# Altium project wireless_pedal.PrjPcb
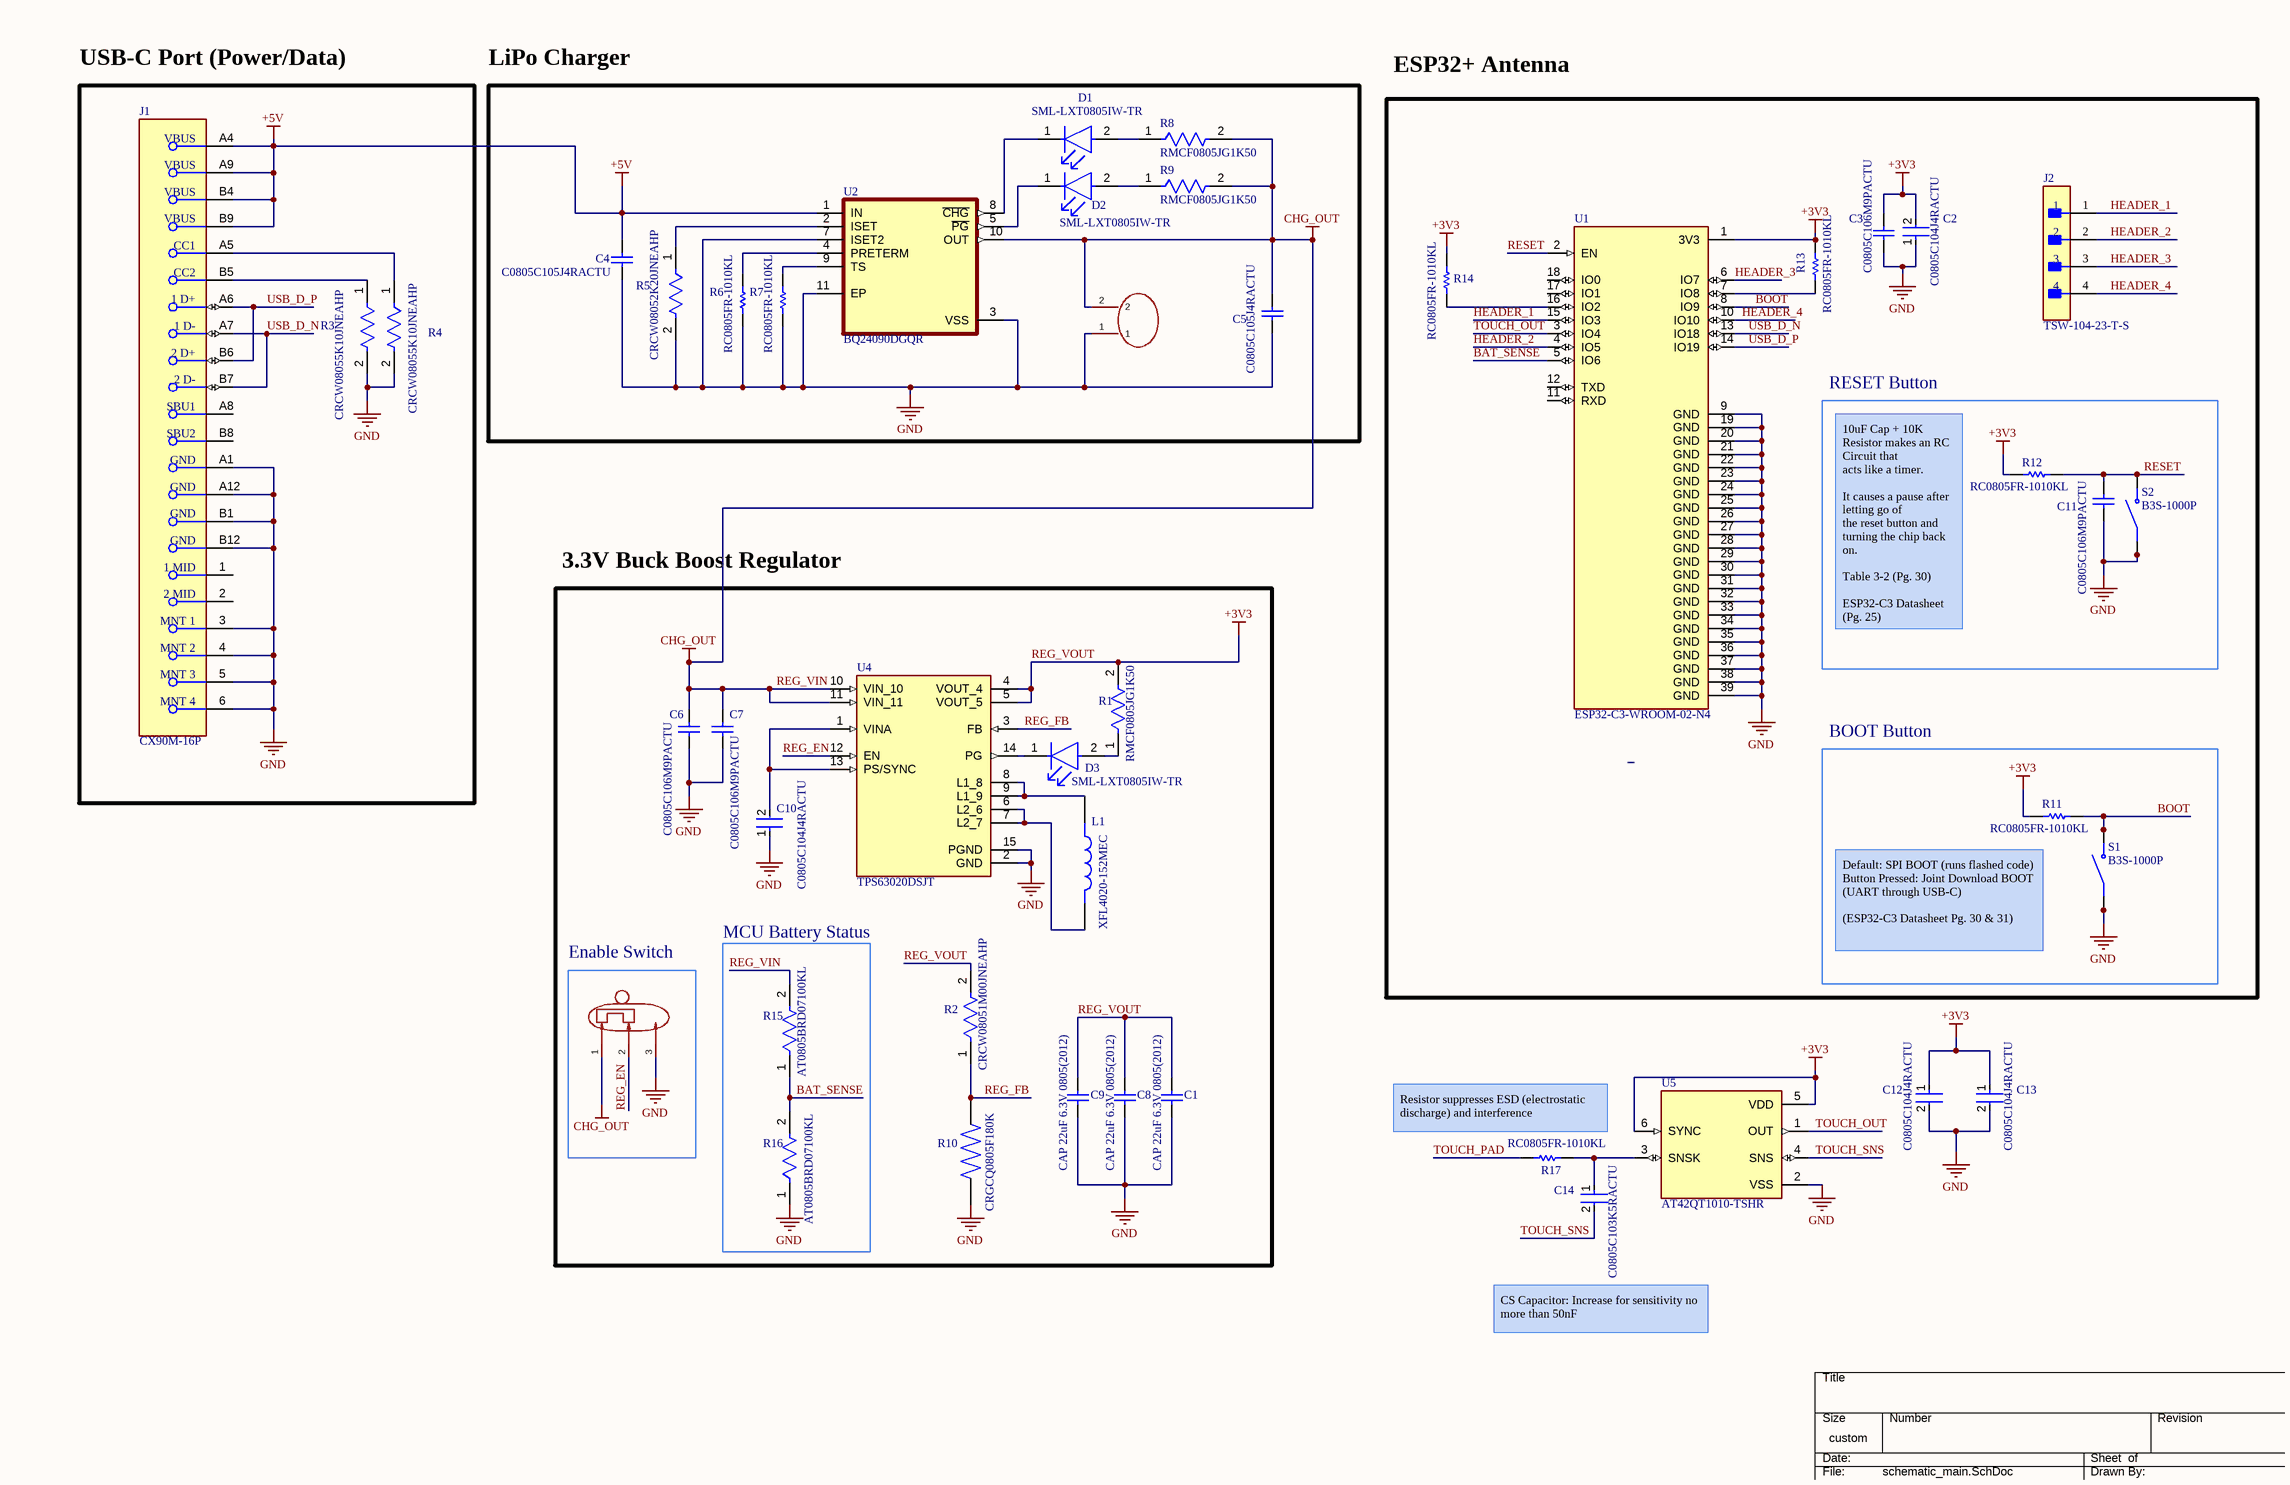
[diagram p0: schematic_main.SchDoc]
1 sheet, 45 parts. Net scope: global (net labels, ports and power ports of the same name join across sheets).
Board files: pcb_main.PcbDoc, pcb_4_layer.PcbDoc

## Sheet schematic_main.SchDoc: *wireless_pedal
size 431 x 279 mm; Author: *Me; DrawnBy: Me; SheetNumber: 1; SheetTotal: 1

### Parts
C1  CAP 22uF 6.3V 0805(2012)  [CAPC0805(2012)145_L]
C2  C0805C104J4RACTU  [FP-C0805C-DN-IPC_A]
C3  C0805C106M9PACTU  [CAPC2013X145X50LL20T25]
C4  C0805C105J4RACTU  [CAPC2013X140X50LL20T25]
C5  C0805C105J4RACTU  [CAPC2013X140X50LL20T25]
C6  C0805C106M9PACTU  [CAPC2013X145X50LL20T25]
C7  C0805C106M9PACTU  [CAPC2013X145X50LL20T25]
C8  CAP 22uF 6.3V 0805(2012)  [CAPC0805(2012)145_L]
C9  CAP 22uF 6.3V 0805(2012)  [CAPC0805(2012)145_L]
C10  C0805C104J4RACTU  [FP-C0805C-DN-IPC_A]
C11  C0805C106M9PACTU  [CAPC2013X145X50LL20T25]
C12  C0805C104J4RACTU  [FP-C0805C-DN-IPC_A]
C13  C0805C104J4RACTU  [FP-C0805C-DN-IPC_A]
C14  C0805C103K5RACTU  [FP-C0805C-DN-IPC_A]
CN1  b2b-ph-k-s(lf)(sn)  [CONN-TH_B2B-PH-K-S]  (value not drawn)
D1  SML-LXT0805IW-TR  [FP-SML-LXT0805IW-TR-MFG]
D2  SML-LXT0805IW-TR  [FP-SML-LXT0805IW-TR-MFG]
D3  SML-LXT0805IW-TR  [FP-SML-LXT0805IW-TR-MFG]
J1  CX90M-16P  [FP-CX90M-16P-MFG]
J2  TSW-104-23-T-S  [FP-TSW-104-23-T-S-MFG]
L1  XFL4020-152MEC  [IND_XFL4020-152MEC]
R1  RMCF0805JG1K50  [FP-RMCF0805-IPC_A]
R2  CRCW08051M00JNEAHP  [FP-CRCW0805-HPe3-IPC_A]
R3  CRCW08055K10JNEAHP  [FP-CRCW0805-HPe3-IPC_A]
R4  CRCW08055K10JNEAHP  [FP-CRCW0805-HPe3-IPC_A]
R5  CRCW08052K20JNEAHP  [FP-CRCW0805-HPe3-IPC_A]
R6  RC0805FR-1010KL  [RESC2013X60X35LL10T20]
R7  RC0805FR-1010KL  [RESC2013X60X35LL10T20]
R8  RMCF0805JG1K50  [FP-RMCF0805-IPC_A]
R9  RMCF0805JG1K50  [FP-RMCF0805-IPC_A]
R10  CRGCQ0805F180K  [RESC2012X65N]
R11  RC0805FR-1010KL  [RESC2013X60X35LL10T20]
R12  RC0805FR-1010KL  [RESC2013X60X35LL10T20]
R13  RC0805FR-1010KL  [RESC2013X60X35LL10T20]
R14  RC0805FR-1010KL  [RESC2013X60X35LL10T20]
R15  AT0805BRD07100KL  [FP-AT0805-IPC_A]
R16  AT0805BRD07100KL  [FP-AT0805-IPC_A]
R17  RC0805FR-1010KL  [RESC2013X60X35LL10T20]
S1  B3S-1000P  [SW_B3S-1000P]
S2  B3S-1000P  [SW_B3S-1000P]
U1  ESP32-C3-WROOM-02-N4  [MODULE_ESP32-C3-WROOM-02-H4]
U2  BQ24090DGQR  [IC_XTR111AIDGQR]
U3  ss-12d00-g3  [SW-TH_3P-L8.8-W3.9-P2.50_SS12D00G3]  (value not drawn)
U4  TPS63020DSJT  [IC_TPS63020DSJT]
U5  AT42QT1010-TSHR  [SOT95P270X145-6N]

### Blocks framed on the sheet
USB-C Port (Power/Data): J1 R3 R4
LiPo Charger: C4 C5 CN1 D1 D2 R5-R9 U2
RESET Button: C11 R12 S2
3.3V Buck Boost Regulator: C1 C6-C10 D3 L1 R1 R2 R10 U4
BOOT Button: R11 S1
Enable Switch: U3
MCU Battery Status: R15 R16

### Nets
+5V: C4.2 J1.A4(VBUS) J1.A9(VBUS) J1.B4(VBUS) J1.B9(VBUS) U2.1(IN)
GND: C1.2 C2.1 C3.2 C4.1 C5.1 C6.1 C7.1 C8.2 C9.2 C10.1 C11.1 C12.2 C13.2 CN1.1 J1.3(MNT_1) J1.4(MNT_2) J1.5(MNT_3) J1.6(MNT_4) J1.A1(GND) J1.A12(GND) J1.B1(GND) J1.B12(GND) R3.2 R4.2 R5.2 R6.1 R7.1 R10.1 R16.1 S1.1(COM) S1.2(COM) S2.1(COM) S2.2(COM) U1.9(GND) U1.19(GND) U1.20(GND) U1.21(GND) U1.22(GND) U1.23(GND) U1.24(GND) U1.25(GND) U1.26(GND) U1.27(GND) U1.28(GND) U1.29(GND) U1.30(GND) U1.31(GND) U1.32(GND) U1.33(GND) U1.34(GND) U1.35(GND) U1.36(GND) U1.37(GND) U1.38(GND) U1.39(GND) U2.3(VSS) U2.7(ISET2) U2.11(EP) U3.3 U4.2(GND) U4.15(PGND) U5.2(VSS)
REG_VIN: C5.2 C6.2 C7.2 CN1.2 R8.2 R9.2 R15.2 U2.10(OUT) U3.1 U4.10(VIN_10) U4.11(VIN_11)  [also labelled CHG_OUT]
REG_VOUT: C1.1 C2.2 C3.1 C8.1 C9.1 C12.1 C13.1 R1.2 R2.2 R11.1 R12.1 R13.2 R14.2 U1.1(3V3) U4.4(VOUT_4) U4.5(VOUT_5) U5.5(VDD) U5.6(SYNC)  [also labelled +3V3]
BAT_SENSE: R15.1 R16.2 U1.5(IO6)
BOOT: R11.2 S1.3(NO) S1.4(NO) U1.8(IO9)
HEADER_1: J2.1 U1.15(IO3)
HEADER_2: J2.2 U1.4(IO5)
HEADER_3: J2.3 U1.6(IO7)
HEADER_4: J2.4 U1.10(IO10)
REG_EN: U3.2 U4.12(EN)
REG_FB: R2.1 R10.2 U4.3(FB)
RESET: C11.2 R12.2 S2.3(NO) S2.4(NO) U1.2(EN)
TOUCH_OUT: U1.3(IO4) U5.1(OUT)
TOUCH_PAD: R17.1
TOUCH_SNS: C14.2 U5.4(SNS)
USB_D_N: J1.A7(1_D-) J1.B7(2_D-) U1.13(IO18)
USB_D_P: J1.A6(1_D+) J1.B6(2_D+) U1.14(IO19)
NetC10_2: C10.2 U4.1(VINA) U4.13(PS/SYNC)
NetC14_1: C14.1 R17.2 U5.3(SNSK)
NetD1_1: D1.1(C) U2.8(~{CHG})
NetD1_2: D1.2(A) R8.1
NetD2_1: D2.1(C) U2.5(~{PG})
NetD2_2: D2.2(A) R9.1
NetD3_1: D3.1(C) U4.14(PG)
NetD3_2: D3.2(A) R1.1
NetJ1_A5: J1.A5(CC1) R4.1
NetJ1_B5: J1.B5(CC2) R3.1
NetL1_1: L1.1 U4.8(L1_8) U4.9(L1_9)
NetL1_2: L1.2 U4.6(L2_6) U4.7(L2_7)
NetR5_1: R5.1 U2.2(ISET)
NetR6_2: R6.2 U2.4(PRETERM)
NetR7_2: R7.2 U2.9(TS)
NetR13_1: R13.1 U1.7(IO8)
NetR14_1: R14.1 U1.16(IO2)

Not connected (* = marked no-connect by the designer): J1 1(1_MID) 2(2_MID) A8(SBU1) B8(SBU2); U1 11(RXD) 12(TXD) 17(IO1) 18(IO0)

### Notes on the sheet
- ESP32+ Antenna
- 10uF Cap + 10K Resistor makes an RC Circuit that
  acts like a timer.
  It causes a pause after letting go of
  the reset button and turning the chip back on.
  Table 3-2 (Pg. 30)
  ESP32-C3 Datasheet (Pg. 25)
- (near R11) Default: SPI BOOT (runs flashed code)
  Button Pressed: Joint Download BOOT (UART through USB-C)
  (ESP32-C3 Datasheet Pg. 30 & 31)
- (near R17) Resistor suppresses ESD (electrostatic discharge) and interference
- CS Capacitor: Increase for sensitivity no more than 50nF
- DWG. NO.
- REV.
- SHT.
- THIS DOCUMENT AND THE DATA DISCLOSED HEREIN OR HEREWITH IS THE PROPERTY OF ALTIUM LIMITED AND MAY BE FREELY DISTRIBUTED IN WHOLE. NO RIGHTS ARE RESERVED OR EXPRESS OR IMPLIED WARANTEE GIVEN.
- REVISION
- DESCRIPTION
- DATE
- APPROVED
- ENG:
- APPROVALS
- PROJECT
- DSN:
- CHK:
- REFERENCE DOCUMENTS
- PROJECT REVISION:
- TITLE
- DOCUMENT REVISION:
- DESIGN ITEM:
- BOM:
- FAB DWG:
- PCB DWG:
- ASSY DWG:
- SCALE:
- SIZE
- B
- CAGE CODE
- FILE NAME
- DWG NO.
- SHEET
- OF
- REV

### Library data of the parts
C1 C8 C9 = CMP-1036-04938-1: CAP 22uF 6.3V ±10% 0805 (2012 Metric) Thickness 1.45mm SMD; Tolerance: Â±10%; Case-EIA: 0805; Case-Metric: 2012; Technology: SMT; Rated Voltage: 6.3 V; Max Thickness: 1.45 mm; Value: 22uF
C2 C10 C12 C13 = CMP-2007-01112-2: CAP CER 0.1UF 16V X7R 0805; Manufacturer: KEMET; Value: 0.10 μF; Material: Ceramic; Temperature Coefficient: 30ppm/°C; Tolerance: 0.05; Mouser Description: Multilayer Ceramic Capacitors MLCC - SMD/SMT 16volts 0.1uF X7R 5%; Device Class L2: Capacitors; Temperature: -55°C to +125°C; RoHS: TRUE; Category: Cap; Octopart: https://octopart.com/c0805c104j4ractu-kemet-12563748; Temperature Range Low: -55°C; ComponentLink2URL: https://content.kemet.com/datasheets/KEM_C1003_C0G_SMD.pdf; Manufacturer Part Number: C0805C104J4RACTU; Ipc Land Pattern Name: CAPC200125X78; Device Class L3: Ceramic Capacitors; Device Class L1: Passive Components; Digikey Description: CAP CER 0.1UF 16V X7R 0805; Temperature Characteristic: X7R; Temperature Range High: +125°C; Package: C0805C-DN; ComponentLink2Description: Datasheet; Capacitance: 0.10 μF; Voltage Rating: 16 V; Height: 0.88mm; Lead Free: Yes; Automotive: No
C3 C6 C7 C11 = CMP-1036-04919-2: CAP CER 10UF 6.3V X5R 0805; Manufacturer: Kemet; Part Number: C0805C106M9PACTU
C4 C5 = CMP-2007-03229-1: 1 µF ±5% 16V Ceramic Capacitor X7R 0805 (2012 Metric); Manufacturer: Kemet; Part Number: C0805C105J4RACTU
C14 = CMP-2007-01079-2: CAP CER 10000PF 50V X7R 0805; Manufacturer: KEMET; Capacitance: 10,000 pF; Material: Ceramic; Tolerance: 0.1; Value: 10,000 pF; Temperature Coefficient: 30ppm/°C; Temperature: -55°C to +125°C; Device Class L3: Ceramic Capacitors; ComponentLink2URL: https://content.kemet.com/datasheets/KEM_C1003_C0G_SMD.pdf; Temperature Range Low: -55°C; Manufacturer Part Number: C0805C103K5RACTU; Ipc Land Pattern Name: CAPC200125X78; Height: 0.88mm; Temperature Range High: +125°C; Category: Cap; ComponentLink2Description: Datasheet; Octopart: https://octopart.com/c0805c103k5ractu-kemet-90536; Package: C0805C-DN; Device Class L2: Capacitors; Voltage Rating: 50 V; RoHS: TRUE; Automotive: No; Digikey Description: CAP CER 10000PF 50V X7R 0805; Temperature Characteristic: X7R; Device Class L1: Passive Components; Lead Free: Yes
CN1 = b2b-ph-k-s(lf)(sn): Pins Structure:1x2P Pitch:2mm Mounting Type:Through Hole Reference Series:PH Number of Pins:2P Number of Rows:1 Number of PINs Per Row:2 Row Spacing:- Current Rating:2A Contact Material:Brass Contact Plating:Tin Operating Temperature:-25℃~+85℃ Operating T; Manufacturer: JST; AddInBom: yes; ModelId: 5cc63648eb1041ff813a836ee0942c91; ModelName: CONN-TH_PH2.00-LI-2P; ModelTransform: 236.25937,181.102,0,180,0,0,0,23.622,-137.795; Pins Structure: 1x2P; Pitch: 2mm; Reference Series: PH; Number of PINs Per Row: 2; Current Rating: 2A; Voltage Rating: 100V; Plastic Material: PA66; Flame Retardant Rating: UL94V-0; Supplementary Features: K Pin; Z-Height of the Board: 6mm; X-Length of Bottom Edge on Board (Spacing Line): 5.9mm; Y-Width of Bottom Edge on Board: 4.5mm; Symbol: B2B-PH-K-S(LF)(SN); LCSC Part Name: 1x2P 间距:2mm 直插 系列:PH; SupplierPart: C131337; ManufacturerPart: B2B-PH-K-S(LF)(SN); Supplier Footprint: 插件,P=2mm; JLCPCB Part Class: Extended Part; Datasheet: https://item.szlcsc.com/datasheet/B2B-PH-K-S(LF)(SN)/142630.html; Supplier: LCSC; ConvertToPcb: yes; FootprintName: CONN-TH_B2B-PH-K-S; Mounting Type: Through Hole; Number of Pins: 2P; Number of Rows: 1; Row Spacing: -; Contact Material: Brass; Contact Plating: Tin; Operating Temperature: -25℃~+85℃; Color: White
D1-D3 = CMP-1724-00002-2: LED RED DIFFUSED SMD; Lens Style: Rectangular; Luminous Intensity: 11mcd; Approvals: UL; Test Current: 20mA; Forward Voltage: 2V; Number of LEDs: 1; Wavelength: 635nm; Lens Color: White; Viewing Angle: 140°; Min Operating Temperature: -25°C; Case Code (Metric): 2012; Mount: Surface Mount; Case Code (Imperial): 0805; Height: 0.8mm; Lead Free: Lead Free; Color: Red; Package Quantity: 1; Illumination Color: Red; Lens Transparency: Diffused; Forward Current: 20mA; Packaging: Tape and Reel; Length: 2mm; Case/Package: 0805; REACH SVHC: No SVHC; Width: 1.25mm; Number of Pins: 2; Max Operating Temperature: 80°C; Dominant Wavelength: 635nm
J1 = CMP-11601-000005-1: CONN RCPT USB2.0 TYPEC 16POS SMD; Connector Type: USB; Current Rating: 1.25A; Mating Cycles: 10000; Number of Contacts: 16; Gender: Receptacle; Shielding: Shielded; Number of Ports: 1; Insulation Color: Black; Termination: Solder; Min Operating Temperature: -30°C; Flammability Rating: UL94 V-0; Max Operating Temperature: 85°C; Packaging: Cut Tape; Contact Plating: Gold; Mount: Surface Mount
J2 = CMP-02766-001388-1: CONN HEADER VERT 4POS 2.54MM; Number of Contacts: 4; Gender: Male; Connector Type: Male Pin; Max Voltage Rating (AC): 550V; Max Current Rating: 7.6A; Radiation Hardening: No; Lead Free: Lead Free; RoHS Compliant: Yes; Contact Material: Bronze; Number of Positions: 4; Housing Color: Black; Min Operating Temperature: -55°C; Mount: Through Hole; Number of Rows: 1; Orientation: Straight; Contact Mating Length: 0.23inch; Contact Type: Male Pin; REACH SVHC: No SVHC; Max Operating Temperature: 105°C; Color: Black; Pitch: 2.54mm; Length: 10.16mm; Series: TSW; Packaging: Bulk; Contact Plating: Tin; Package Quantity: 1; Termination: Solder; Housing Material: Polyester; Width: 2.54mm; Depth: 2.54mm
L1 = XFL4020-152MEC: Inductor Power Shielded Wirewound 1.5uH 20% 100KHz 9.1A 15.8mOhm DCR 1515 Automotive Embossed Plastic T/R; MF: Coilcraft; SnapEDA_Link: https://www.snapeda.com/parts/XFL4020-152MEC/Coilcraft/view-part/?ref=snap; Package: None; Value: *; MP: XFL4020-152MEC; Check_prices: https://www.snapeda.com/parts/XFL4020-152MEC/Coilcraft/view-part/?ref=eda
R1 R8 R9 = CMP-26527-004339-1: 1.5kΩ ±5% 0.125W 0805 Thick Film Chip Resistor AEC-Q200 compliant; Resistance: 1.5kR; Temperature Coefficient: 200ppm/°C; Max Power Dissipation: 125mW; Contact Plating: Tin; Resistor Type: Thick Film; Min Operating Temperature: -55°C; Height: 0.026inch; Radiation Hardening: No; Length: 0.079inch; Case/Package: 0805; Mount: Surface Mount; Width: 0.049inch; Number of Terminations: 2; RoHS Compliant: Yes; Series: RMCF; Max Operating Temperature: 155°C; Packaging: Tape and Reel; Features: Automotive AEC-Q200; Tolerance: 5%
R2 = CMP-02407-004826-1: RES Thick Film, 1MΩ, 5%, 0.5W, 200ppm/°C, 0805; Power Rating: 330mW; Voltage Rating: 150V; Max Power Dissipation: 333mW; Resistance: 1MR; Case/Package: 0805; Radiation Hardening: No; Packaging: Tape and Reel; Temperature Coefficient: 200ppm/°C; Lead Free: Lead Free; Termination: SMD/SMT; Min Operating Temperature: -55°C; Number of Terminations: 2; Length: 0.079inch; Tolerance: 5%; Features: Automotive AEC-Q200; Max Operating Temperature: 155°C; Weight: 0.000194oz; Case Code (Metric): 2012; Height: 0.024inch; Case Code (Imperial): 0805; Package Quantity: 1; Width: 0.049inch; Contact Plating: Tin; Composition: Thick Film
R3 R4 = CMP-02407-002962-1: RES Thick Film, 5.1kΩ, 5%, 0.5W, 200ppm/°C, 0805; Resistance: 5.1kR; Max Power Dissipation: 500mW; Packaging: Tape and Reel; Max Operating Temperature: 155°C; Min Operating Temperature: -55°C; Tolerance: 5%; Temperature Coefficient: 200ppm/°C; Case/Package: 0805; Package Quantity: 5000; Height: 0.024inch; Features: Automotive AEC-Q200; Width: 0.049inch; Length: 0.079inch; Lead Free: Lead Free; Composition: Thick Film; Number of Terminations: 2
R5 = CMP-02407-006246-1: RES Thick Film, 2.2kΩ, 5%, 0.5W, 200ppm/°C, 0805; Voltage Rating: 150V; Resistance: 2.2kR; Max Power Dissipation: 333mW; Power Rating: 500mW; Package Quantity: 1; Width: 0.049inch; Tolerance: 5%; Case Code (Metric): 2012; Features: Automotive AEC-Q200; Case Code (Imperial): 0805; Height: 0.024inch; Max Operating Temperature: 155°C; Length: 0.079inch; Radiation Hardening: No; Termination: SMD/SMT; Number of Terminations: 2; Case/Package: 0805; Temperature Coefficient: 200ppm/°C; Packaging: Tape and Reel; Weight: 0.000194oz; Contact Plating: Tin; Lead Free: Lead Free; Min Operating Temperature: -55°C; Composition: Thick Film
R6 R7 R11-R14 R17 = CMP-2001-04512-1: RES 10K OHM 1% 1/8W 0805; Manufacturer: Yageo; Part Number: RC0805FR-1010KL
R10 = CRGCQ0805F180K: 180 kOhms Â±1% 0.125W, 1/8W Chip Resistor 0805 (2012 Metric) Automotive AEC-Q200, Moisture Resistant Thick Film; MF: TE Connectivity; SnapEDA_Link: https://www.snapeda.com/parts/CRGCQ0805F180K/TE+Connectivity+Passive+Product/view-part/?ref=snap; Package: 2012 TE Connectivity; Value: *; MP: CRGCQ0805F180K; Check_prices: https://www.snapeda.com/parts/CRGCQ0805F180K/TE+Connectivity+Passive+Product/view-part/?ref=eda
R15 R16 = CMP-03412-042085-1: Thin Film Chip Resistors Automotive Grade 100kΩ 0.1% 25ppm/°C 0805; Max Power Dissipation: 125mW; Resistance: 100kR; Max Operating Temperature: 155°C; Length: 0.079inch; RoHS Compliant: Yes; Packaging: Tape and Reel; Min Operating Temperature: -55°C; Case/Package: 0805; Tolerance: 0.1%; Number of Terminations: 2; Temperature Coefficient: 25ppm/°C; Height: 0.024inch; Series: AT; Features: Moisture Resistant; Width: 0.049inch; Resistor Type: Thin Film
S1 S2 = B3S-1000P: Tactile Switch SPST-NO Top Actuated Surface Mount; Value: *; Package: None; MP: B3S-1000P; Price: None; Availability: Unavailable
U1 = ESP32-C3-WROOM-02-N4: WiFi Modules (802.11) (Engineering Samples) SMD module, ESP32-C3, 4MB SPI flash, PCB antenna, -40 C +85 C; MF: Espressif Systems; Value: *; SnapEDA_Link: https://www.snapeda.com/parts/ESP32-C3-WROOM-02-N4/Espressif+Systems/view-part/?ref=snap; Purchase-URL: https://pricing.snapeda.com/search/part/ESP32-C3-WROOM-02-N4/?ref=eda; Availability: In Stock; Price: None; Package: Package; Check_prices: https://www.snapeda.com/parts/ESP32-C3-WROOM-02-N4/Espressif+Systems/view-part/?ref=eda; MP: ESP32-C3-WROOM-02-N4
U2 = BQ24090DGQR: 1-cell, 1-A, Li-ion linear battery charger w/ 10kÎ© NTC; MF: Texas Instruments; SnapEDA_Link: https://www.snapeda.com/parts/BQ24090DGQR/Texas+Instruments/view-part/?ref=snap; Package: HVSSOP-10 Texas Instruments; Value: *; MP: BQ24090DGQR; Check_prices: https://www.snapeda.com/parts/BQ24090DGQR/Texas+Instruments/view-part/?ref=eda
U3 = ss-12d00-g3: Circuit:SPDT Actuator Style:Rectangular Columnar Termination Style:PC Pin Length:8.8mm Width:3.9mm Switch Height:7.2mm Mounting Type:Through Hole Actuator Color:Black Operating Temperature:-35℃~+75℃ Operating Temperature:-35℃~+75℃; Manufacturer: SOFNG(硕方); AddInBom: yes; ModelId: 73abde54055d465790e8480c42fb2657; ModelTransform: 346.495,153.54304,0,0,0,0,0,0,-102.362; Circuit: SPDT; Switch Height: 7.2mm; Actuator Color: Black; Symbol: SS-12D00-G3; LCSC Part Name: 大型拨动开关; SupplierPart: C22355741; ManufacturerPart: SS-12D00-G3; Supplier Footprint: 插件-3P,8.8x3.9mm; JLCPCB Part Class: Extended Part; Datasheet: https://item.szlcsc.com/datasheet/SS-12D00-G3/23787622.html; Supplier: LCSC; ConvertToPcb: yes; FootprintName: SW-TH_3P-L8.8-W3.9-P2.50_SS12D00G3; ModelName: SW-TH_3P-L8.8-W3.9-P2.50_SS12D00G3; Actuator Style: Rectangular Columnar; Termination Style: PC Pin; Length: 8.8mm; Width: 3.9mm; Mounting Type: Through Hole; Operating Temperature: -35℃~+75℃
U4 = TPS63020DSJT: High Efficiency Single Inductor Buck-Boost Converter with 4A Switch; MF: Texas Instruments; SnapEDA_Link: https://www.snapeda.com/parts/TPS63020DSJT/Texas+Instruments/view-part/?ref=snap; Package: VSON-14 Texas Instruments; Value: *; MP: TPS63020DSJT; Check_prices: https://www.snapeda.com/parts/TPS63020DSJT/Texas+Instruments/view-part/?ref=eda
U5 = AT42QT1010-TSHR: Capacitive Touch Buttons SOT-23-6; MF: Microchip; SnapEDA_Link: https://www.snapeda.com/parts/AT42QT1010-TSHR/Microchip/view-part/?ref=snap; Package: SOT-23-6 Microchip; Value: *; MP: AT42QT1010-TSHR; Check_prices: https://www.snapeda.com/parts/AT42QT1010-TSHR/Microchip/view-part/?ref=eda